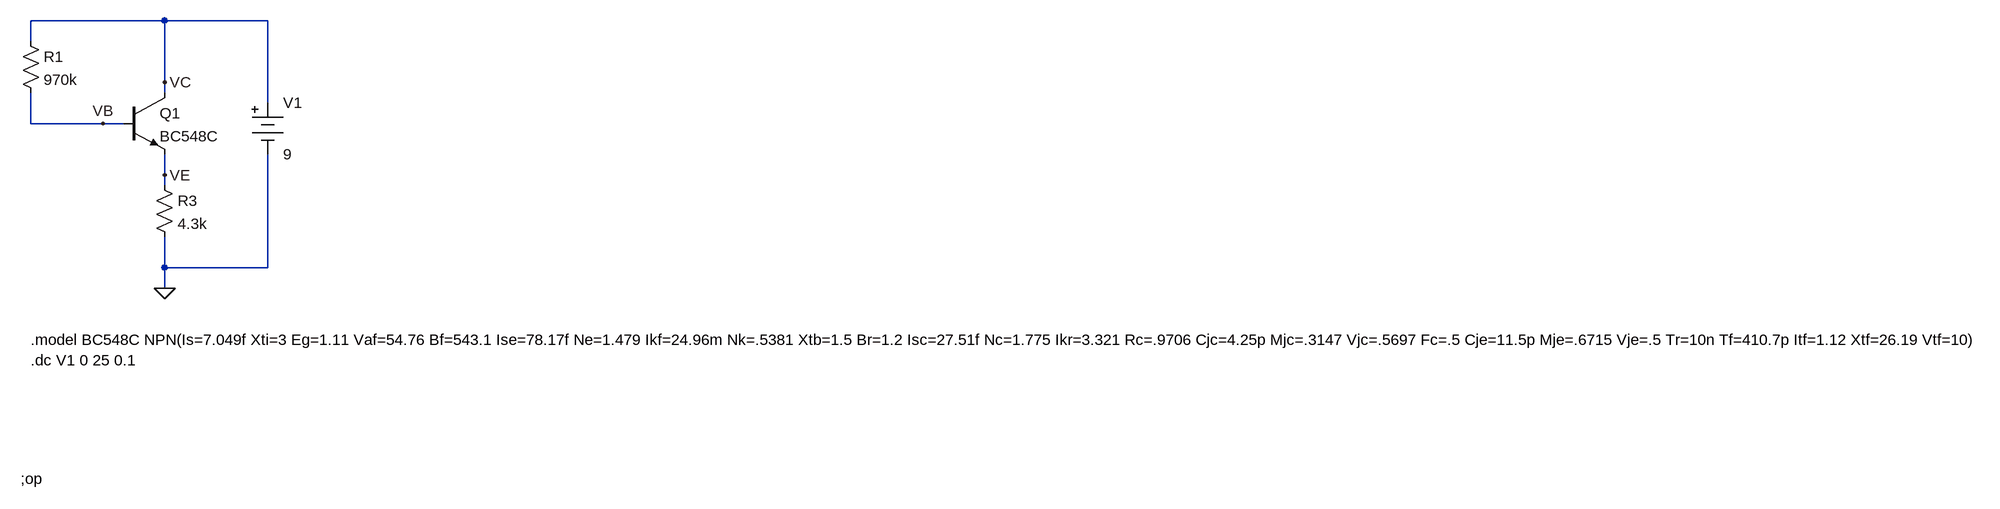
[diagram p0: schematic 3_12_tp3_ej5_pablo_gomez.asc]
3_12_tp3_ej5_pablo_gomez.asc, the LTspice schematic file:
Version 4
SHEET 1 3340 728
WIRE 176 0 -32 0
WIRE 336 0 176 0
WIRE -32 32 -32 0
WIRE 176 96 176 0
WIRE 176 112 176 96
WIRE 336 128 336 0
WIRE -32 160 -32 112
WIRE 80 160 -32 160
WIRE 112 160 80 160
WIRE 176 240 176 208
WIRE 176 256 176 240
WIRE 176 384 176 336
WIRE 336 384 336 208
WIRE 336 384 176 384
WIRE 176 416 176 384
FLAG 176 416 0
FLAG 176 240 VE
FLAG 176 96 VC
FLAG 80 160 VB
SYMBOL Misc\\battery 336 112 R0
WINDOW 123 0 0 Left 0
WINDOW 39 0 0 Left 0
SYMATTR InstName V1
SYMATTR Value 9
SYMBOL res -48 16 R0
SYMATTR InstName R1
SYMATTR Value 970k
SYMBOL res 160 240 R0
SYMATTR InstName R3
SYMATTR Value 4.3k
SYMBOL npn 112 112 R0
SYMATTR InstName Q1
SYMATTR Value BC548C
TEXT -32 496 Left 2 !.model BC548C NPN(Is=7.049f Xti=3 Eg=1.11 Vaf=54.76 Bf=543.1 Ise=78.17f Ne=1.479 Ikf=24.96m Nk=.5381 Xtb=1.5 Br=1.2 Isc=27.51f Nc=1.775 Ikr=3.321 Rc=.9706 Cjc=4.25p Mjc=.3147 Vjc=.5697 Fc=.5 Cje=11.5p Mje=.6715 Vje=.5 Tr=10n Tf=410.7p Itf=1.12 Xtf=26.19 Vtf=10)
TEXT -48 712 Left 2 !;op
TEXT -32 528 Left 2 !.dc V1 0 25 0.1

The netlist it stands for:
* 3_12_tp3_ej5_pablo_gomez.asc
V1 VC 0 9
R1 VC VB 970k
R3 VE 0 4.3k
Q1 VC VB VE 0 BC548C
.model NPN NPN
.model PNP PNP
.lib standard.bjt
.model BC548C NPN(Is=7.049f Xti=3 Eg=1.11 Vaf=54.76 Bf=543.1 Ise=78.17f Ne=1.479 Ikf=24.96m Nk=.5381 Xtb=1.5 Br=1.2 Isc=27.51f Nc=1.775 Ikr=3.321 Rc=.9706 Cjc=4.25p Mjc=.3147 Vjc=.5697 Fc=.5 Cje=11.5p Mje=.6715 Vje=.5 Tr=10n Tf=410.7p Itf=1.12 Xtf=26.19 Vtf=10)
;op
.dc V1 0 25 0.1
.backanno
.end